# EAGLE design ezo_a1 (EAGLE 5.11)
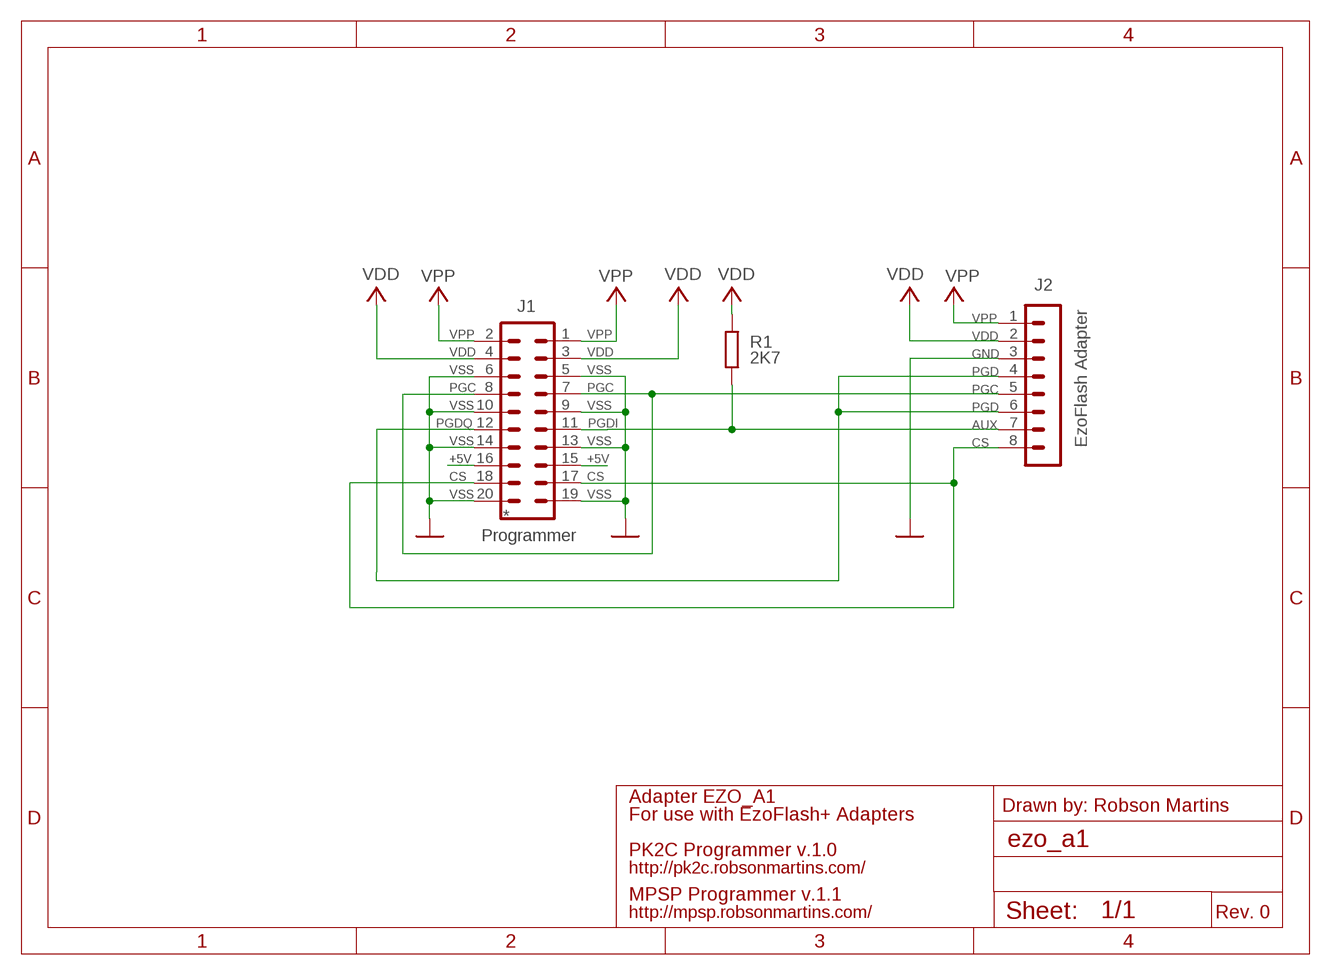
[diagram p0: schematic, sheet 1]

## Parts
J1  Programmer  MA10-2  [MA10-2]
J2  EzoFlash Adapter  MA08-1W  [MA08-1W]
R1  2K7  R-EU_0204/7  [0204/7]

## Nets
+5V: J1.15 J1.16
AUX: J1.11 J2.7 R1.1
CS: J1.17 J1.18 J2.8
GND: J1.5 J1.6 J1.9 J1.10 J1.13 J1.14 J1.19 J1.20 J2.3
PGC: J1.7 J1.8 J2.5
PGD: J1.12 J2.4 J2.6
VDD: J1.3 J1.4 J2.2 R1.2
VPP: J1.1 J1.2 J2.1

## Notes on the sheet
- VPP | VPP
- VDD | VDD
- VSS | VSS
- PGC | PGC
- VSS | VSS
- PGDQ | PGDI
- VSS | VSS
- +5V | +5V
- CS | CS
- VSS | VSS
- *
- Adapter EZO_A1
- Drawn by: Robson Martins
- For use with EzoFlash+ Adapters
- PK2C Programmer v.1.0
- http://pk2c.robsonmartins.com/
- MPSP Programmer v.1.1
- http://mpsp.robsonmartins.com/ | Rev. 0

## Library data of the parts
J1 = con-lstb:MA10-2: PIN HEADER; OC_FARNELL: unknown; OC_NEWARK: unknown
J2 = con-lstb:MA08-1W: PIN HEADER; OC_FARNELL: unknown; OC_NEWARK: unknown
R1 = rcl:R-EU_: RESISTOR, European symbol

## Board
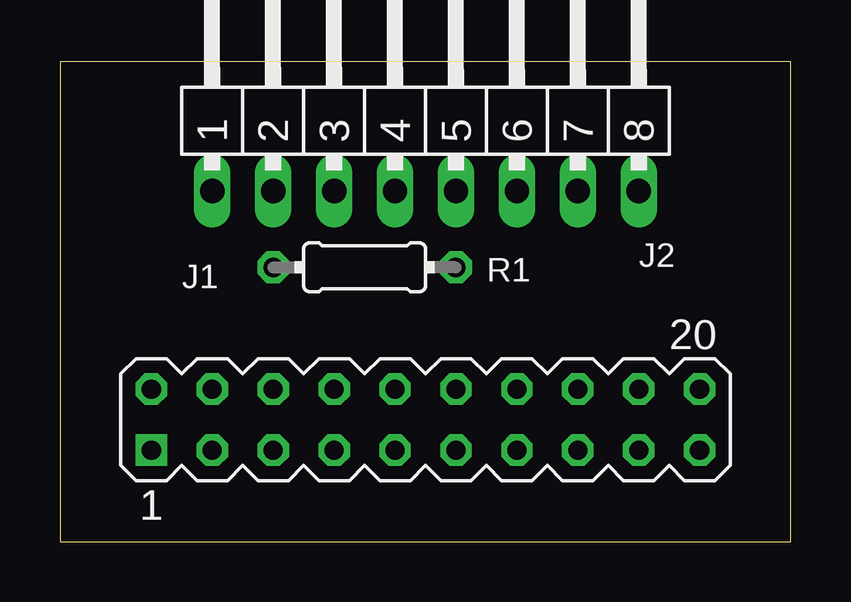
[diagram p1: board, top side]
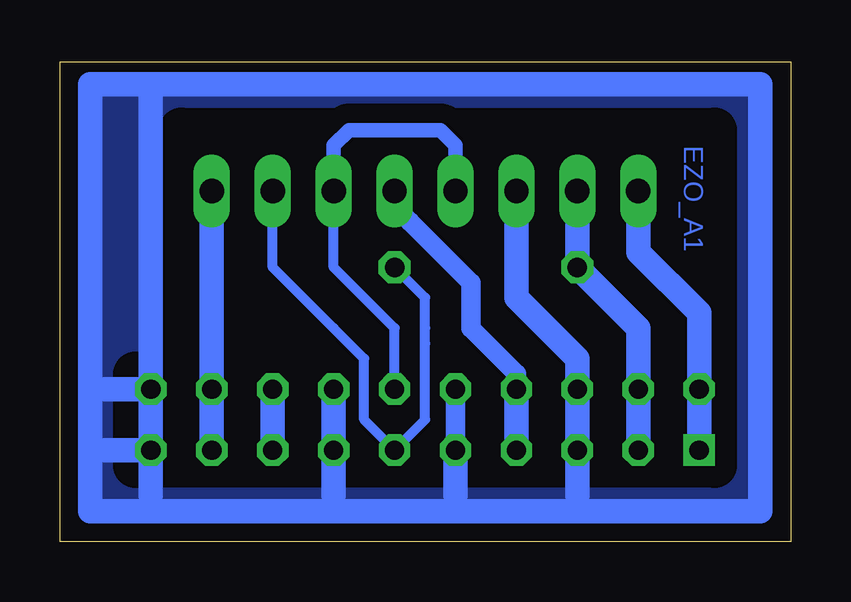
[diagram p2: board, bottom side, seen from below]

Size 30.46 x 19.99 mm. Coordinates in mm from the lower left corner, seen from the top.
Outline: 0,0 30.46,0 30.46,19.99 0,19.99 0,0
Copper layers (1*16): Top 0.035mm / dielectric 1.5mm / Bottom 0.035mm
Design rules "default": minimum track width 10mil, minimum drill 24mil, track to track 8mil, track to pad 8mil, pad to pad 8mil, via to via 8mil, smd to smd 8mil, copper to edge 40mil, drill to drill 8mil, minimum pad ring 10mil, minimum via ring 8mil, stop-mask expansion 4mil, vias tented up to drill 0mil, thermal gap 10mil
bRestrict: area 3.2,3.2 to 27.3,7; area 3.2,7 to 25.4,17.1

### Footprints (pad centres in the part's own frame; a part is rotated, then mirrored left to right if it is on the bottom)
MA10-2 = drill 0.8 pad 1.27 square: 1 -11.43,-1.27 | drill 0.8 pad 1.27 octagon: 2 -11.43,1.27; 3 -8.89,-1.27; 4 -8.89,1.27; 5 -6.35,-1.27; 6 -6.35,1.27; 7 -3.81,-1.27; 8 -3.81,1.27; 9 -1.27,-1.27; 10 -1.27,1.27; 11 1.27,-1.27; 12 1.27,1.27; 13 3.81,-1.27; 14 3.81,1.27; 15 6.35,-1.27; 16 6.35,1.27; 17 8.89,-1.27; 18 8.89,1.27; 19 11.43,-1.27; 20 11.43,1.27
MA08-1W = drill 1.016 long: 1 -8.89,0; 2 -6.35,0; 3 -3.81,0; 4 -1.27,0; 5 1.27,0; 6 3.81,0; 7 6.35,0; 8 8.89,0
0204/7 = drill 0.813 octagon: 1 -3.81,0; 2 3.81,0

### Placement (x,y rotation side)
J1  15.24,5.08 0 top
J2  15.24,14.61 0 top
R1  12.7,11.43 180 top

### Tracks (layer width: path | path; a pad name or v marks a point on that pad's centre or on a via)
+5V
  Bottom 1.016: J1.15 J1.16
AUX
  Bottom 0.406: R1.1 15.24,10.16 15.24,8.89 15.24,8.26 15.24,5.08 J1.11 17.78,5.08 17.78,7.62 19.05,8.89 21.59,11.43 J2.7
CS
  Bottom 1.016: J1.17 J1.18 J2.8
GND
  Bottom 0.813: J1.9 J1.10
  Bottom 1.016: J1.14 J1.13 19.05,1.91 | J1.19 J1.20 | J2.3 11.43,10.16 8.89,7.62 J1.6 J1.5 8.89,1.91 | J1.19 J1.20 | 26.67,1.91 J1.19 | 13.97,1.91 J1.9 | J1.20 26.67,19.05 | J1.19 28.57,3.81 | J1.20 28.57,6.35 | 1.27,19.05 29.21,19.05 29.21,1.27 1.27,1.27 1.27,19.05
  pour Bottom (isolate 0.813): 30.48,0 0,0 0,19.68 30.48,19.68
PGC
  Bottom 0.813: J1.8 11.43,6.99 13.34,8.89 13.34,10.79 15.88,13.34 16.51,13.97 J2.5
  Bottom 1.016: J1.8 11.43,5.08 J1.7
PGD
  Bottom 0.406: J1.12 16.51,8.89 18.41,10.79 19.05,11.43 J2.6
  Bottom 0.61: J2.6 19.05,16.51 18.41,17.14 14.61,17.14 13.97,16.51 J2.4
VDD
  Bottom 1.016: J1.3 J1.4 6.35,8.89 R1.2 J2.2
VPP
  Bottom 1.016: J1.2 J1.1 3.81,9.53 6.35,12.06 J2.1

### Text on the board
Bottom: EZO_A1
tDocu: 1 | EzoFlash+ | VSS | EZO_A1 Adapter | VPP | VDD | VSS | PGC | VSS | PGD | VSS | +5V | CS